# Altium project WCE_NanEyeC_board.PrjPcb
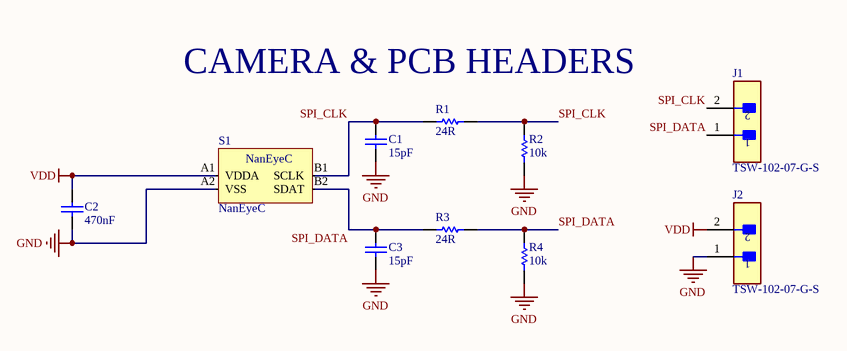
[diagram p0: WCE_NanEyeC_board.SchDoc]
1 sheet, 10 parts. Net scope: global (net labels, ports and power ports of the same name join across sheets).
Board file: WCE_NanEyeC_board.PcbDoc

## Sheet WCE_NanEyeC_board.SchDoc
size A; SheetNumber: 1; SheetTotal: 1

### Parts
C1  15pF  [CAPC1608X90X35NL15T15]
C2  470nF  [CAPC1608X90X35NL15T15]
C3  15pF  [CAPC1608X90X35NL15T15]
J1  TSW-102-07-G-S  [FP-TSW-102-07-G-S-MFG]
J2  TSW-102-07-G-S  [FP-TSW-102-07-G-S-MFG]
R1  24R  [RESC1608X50X30ML20T20]
R2  10k  [RESC1608X50X30ML20T20]
R3  24R  [RESC1608X50X30ML20T20]
R4  10k  [RESC1608X50X30ML20T20]
S1  NanEyeC  [NanEyeC]

### Nets
GND: C1.1 C2.1 C3.1 J2.1 R2.1 R4.1 S1.A2(VSS)
VDD: C2.2 J2.2 S1.A1(VDDA)
SPI_CLK: C1.2 J1.2 R1.1 R1.2 R2.2 S1.B1(SCLK)
SPI_DATA: C3.2 J1.1 R3.1 R3.2 R4.2 S1.B2(SDAT)

### Notes on the sheet
- CAMERA & PCB HEADERS

### Library data of the parts
C1-C3 = CMP-2006-04463-1: Manufacturer: AVX Interconnect / Elco; Part Number: 06035D104KAT2A
J1 J2 = CMP-02766-000084-1: CONN HEADER VERT 2POS 2.54MM; Manufacturer: Samtec; Number Of Contacts: 2; Voltage Rating: 550V; Conn Orientation: Straight; Current Rating: 6.3A; Conn Gender: Male; Package: TSW-102-07-G-S; Digikey Description: CONN HEADER VERT 2POS 2.54MM; ComponentLink2URL: http://suddendocs.samtec.com/catalog_english/tsw_th.pdf; Height: 8.71mm; Temperature: -55°C to +125°C; Device Class L2: Headers and Wire Housings; ComponentLink2Description: Datasheet; Device Class L3: unset; Contact Material: Gold,Nickel; Temperature Range Low: -55°C; Temperature Range High: +125°C; RoHS: TRUE; Device Class L1: Connectors; Mouser Description: Conn Unshrouded Header HDR 2 POS 2.54mm Solder ST Thru-Hole Automotive Bulk; Number Of Rows: 1; Category: Conn; Pitch: 2.54mm; Lead Free: Yes; Automotive: No; Manufacturer Part Number: TSW-102-07-G-S; Footprint Url: http://suddendocs.samtec.com/prints/tsw-xxx-xx-x-x-xx-xxx-footprint.pdf; Octopart: https://octopart.com/tsw-102-07-g-s-samtec-272197
R1-R4 = CMP-2000-02665-1: Part Number: RR0816P-4640-D-65A; Manufacturer: Susumu
S1 = NanEyeC: Camera module NanEyeC from AMS. The Part will be delivered by us